# Altium project Car_Follower_Controller.PrjPcb
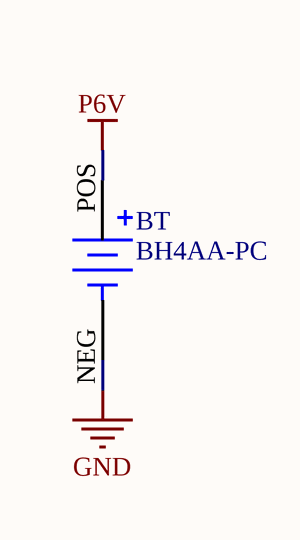
[diagram p0: Connectors.SchDoc]
5 sheets, 25 parts. Net scope: flat (ports and power ports of the same name join across sheets).
Board file: Auto_Follower_Controller.PcbDoc
Sheets:
  Connectors.SchDoc
  Main.SchDoc
  Power_Tree.SchDoc
  STM32.SchDoc
  STM32_Interfaces.SchDoc

## Sheet Connectors.SchDoc
size A; SheetNumber: 1; SheetTotal: 5

### Parts
BT  BH4AA-PC  [BAT_BH4AA-PC]

### Nets
GND: BT.NEG
P6V: BT.POS

### Library data of the parts
BT = BH4AA-PC: Battery Holder _Open_ AA 4 Cell PC Pin; MP: BH4AAPC; MF: MPD; Availability: Unavailable; SnapEDA_Link: https://www.snapeda.com/parts/BH4AAPC/MPD/view-part/112528/?ref=snap; Price: None; Package: None; Value: *

## Sheet Main.SchDoc
size A; SheetNumber: 1; SheetTotal: 3

## Sheet Power_Tree.SchDoc
size A; SheetNumber: 3; SheetTotal: 5
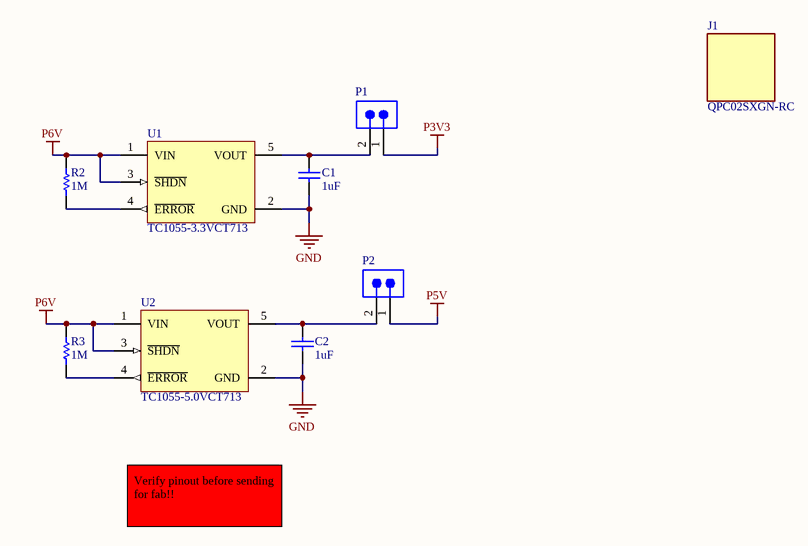
[diagram p1: Power_Tree.SchDoc]

### Parts
C1  value 1uF  [FOOTPRINT-1206-GEN]  (hidden comment: 1206 1uF)
C2  value 1uF  [FOOTPRINT-1206-GEN]  (hidden comment: 1206 1uF)
J1  QPC02SXGN-RC  [FP-QPC02SXGN-RC-MFG]
P1  TSW-102-26-F-S  [SMTC-TSW-102-26-XX-S]  (value not drawn)
P2  TSW-102-26-F-S  [SMTC-TSW-102-26-XX-S]  (value not drawn)
R2  1M  [RESC3116X65X50NL20T20]
R3  1M  [RESC3116X65X50NL20T20]
U1  TC1055-3.3VCT713  [SOT-23-CT5_L]
U2  TC1055-5.0VCT713  [SOT-23-CT5_N]

### Nets
GND: C1.1 C2.1 U1.2(GND) U2.2(GND)
P3V3: P1.1
P5V: P2.1
P6V: R2.2 R3.2 U1.1(VIN) U1.3(~{SHDN}) U2.1(VIN) U2.3(~{SHDN})
NetC1_2: C1.2 P1.2 U1.5(VOUT)
NetC2_2: C2.2 P2.2 U2.5(VOUT)
NetR2_1: R2.1 U1.4(~{ERROR})
NetR3_1: R3.1 U2.4(~{ERROR})

### Notes on the sheet
- Verify pinout before sending for fab!!

### Library data of the parts
C1 C2 = CMP-001-00085-2: CAP CER 1UF 50V X7R 1206 ±10% 50V Ceramic Capacitor X7R 1206 (3216 Metric); Part Number: 1276-6781-1-ND; Published: 8-Jun-2000; LatestRevisionNote: Re-released for DXP Platform.; PackageReference: RAD-0.3; Publisher: Altium Limited; PackageDescription: Radial Cap, Thru-Hole; 2 Leads; 0.3 in Pin Spacing; Design Item ID: Capacitor-Generic-1206; Source: Generic.SchLib; Type: Capacitor
J1 = CMP-25666-000001-1: CONN JUMPER SHORTING .100" GOLD; Manufacturer: Sullins; Conn Orientation: Straight; Pitch: 2.54mm; Current Rating: 3A; Number Of Contacts: 2; Category: Conn; Temperature Range Low: -40°C; Temperature Range High: +85°C; Device Class L1: Connectors; Lead Free: Yes; Manufacturer Part Number: QPC02SXGN-RC; Automotive: No; Height: 6.17mm; ComponentLink2URL: https://s3.amazonaws.com/catalogspreads-pdf/PAGE128-129%20.100%20JUMPER.pdf; Device Class L2: unset; Footprint Url: https://drawings-pdf.s3.amazonaws.com/11510.pdf; Device Class L3: unset; Temperature: -40°C to +85°C; RoHS: TRUE; Digikey Description: CONN JUMPER SHORTING .100" GOLD; Octopart: https://octopart.com/qpc02sxgn-rc-sullins-19878795; Package: 0; ComponentLink2Description: Datasheet; Contact Material: Gold
P1 P2 = CMP-002-00072-1: Headers & Wire Housings Classic PCB Header Strips, 0.100 pitch; Number of Positions: 2; Max Voltage Rating (AC): 550V; Gender: Male; Pitch: 2.54mm; Contact Post Length: 3.2mm; Voltage Rating: 500V; Max Current Rating: 7.6A; Contact Material: Bronze; Contact Gender: Male; Contact Type: -; REACH SVHC: No SVHC; Min Operating Temperature: -55°C; Housing Material: Polyester; Packaging: Bulk; Termination: Through Hole; Max Operating Temperature: 125°C; Orientation: Vertical; Flammability Rating: UL94 V-0; Package Quantity: 1; Depth: 2.54mm; Contact Plating: Gold; Number of Rows: 1; Radiation Hardening: No; Number of Contacts: 2; Length: 5.08mm; RoHS Compliant: Yes; Housing Color: Black; Weight: 0.001257oz; Contact Mating Length: 5.84mm; Series: TSW
R2 R3 = CMP-2003-04887-1: CRCW12061M00FKEAHP / 1M 1206; Manufacturer: Vishay Dale; Part Number: CRCW12061M00FKEAHP
U1 = CMP-0136-00572-1: 50 mA, 100 mA and 150 mA CMOS LDOs with Shutdown and Active-Low Error Output, 5-Pin SOT-23, Extended Temperature, Tape and Reel; PackageVersion: revBB, Aug-2009; PackageDescription: 5-Lead Plastic Small Outline Transistor (CT) [SOT-23]; PackageReference: SOT-23-CT5; Code_IPC: SOT23-5; DatasheetVersion: revD, Feb-2007
U2 = CMP-0136-00550-1: 50 mA, 100 mA and 150 mA CMOS LDOs with Shutdown and Active-Low Error Output, 5-Pin SOT-23, Extended Temperature, Tape and Reel; PackageReference: SOT-23-CT5; PackageDescription: 5-Lead Plastic Small Outline Transistor (CT) [SOT-23]; Code_IPC: SOT23-5; DatasheetVersion: revD, Feb-2007; PackageVersion: revBB, Aug-2009

## Sheet STM32.SchDoc
size A; SheetNumber: 4; SheetTotal: 5
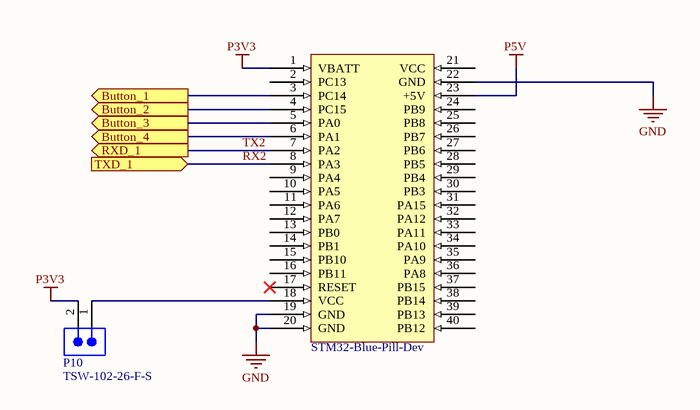
[diagram p2: STM32.SchDoc]

### Parts
(Parts that share a designator on the sheet are numbered #1, #2 ... from top to bottom, then left to right.)
*#1  STM32-Blue-Pill-Dev  [STM32-Blue-Pill-Dev-Headers]
P10  TSW-102-26-F-S  [SMTC-TSW-102-26-XX-S]

### Ports
Button_1 (out), Button_2 (out), Button_3 (out), Button_4 (out), RXD_1 (out), TXD_1 (in)

### Nets
GND: *#1.19(GND) *#1.20(GND) *#1.22(GND)
P3V3: *#1.1(VBATT) P10.2
P5V: *#1.23(+5V)
RX2: *#1.8(PA3) ; port TXD_1
TX2: *#1.7(PA2) ; port RXD_1
Net*#1_3: *#1.3(PC14) ; port Button_1
Net*#1_4: *#1.4(PC15) ; port Button_2
Net*#1_5: *#1.5(PA0) ; port Button_3
Net*#1_6: *#1.6(PA1) ; port Button_4
Net*#1_18: *#1.18(VCC) P10.1

Not connected (* = marked no-connect by the designer): *#1 2(PC13) 9(PA4) 10(PA5) 11(PA6) 12(PA7) 13(PB0) 14(PB1) 15(PB10) 16(PB11) 17(RESET)* 21(VCC) 24(PB9) 25(PB8) 26(PB7) 27(PB6) 28(PB5) 29(PB4) 30(PB3) 31(PA15) 32(PA12) 33(PA11) 34(PA10) 35(PA9) 36(PA8) 37(PB15) 38(PB14) 39(PB13) 40(PB12)

### Library data of the parts
P10 = CMP-002-00072-1: as P1 on sheet Power_Tree; Contact Material: Bronze; Contact Gender: Male; Contact Type: -; REACH SVHC: No SVHC; Min Operating Temperature: -55°C; Housing Material: Polyester; Packaging: Bulk; Termination: Through Hole; Max Operating Temperature: 125°C; Orientation: Vertical; Flammability Rating: UL94 V-0; Package Quantity: 1; Depth: 2.54mm; Contact Plating: Gold; Number of Rows: 1; Radiation Hardening: No; Number of Contacts: 2; Length: 5.08mm; RoHS Compliant: Yes; Housing Color: Black; Weight: 0.001257oz; Contact Mating Length: 5.84mm; Series: TSW

## Sheet STM32_Interfaces.SchDoc
size A; SheetNumber: 5; SheetTotal: 5
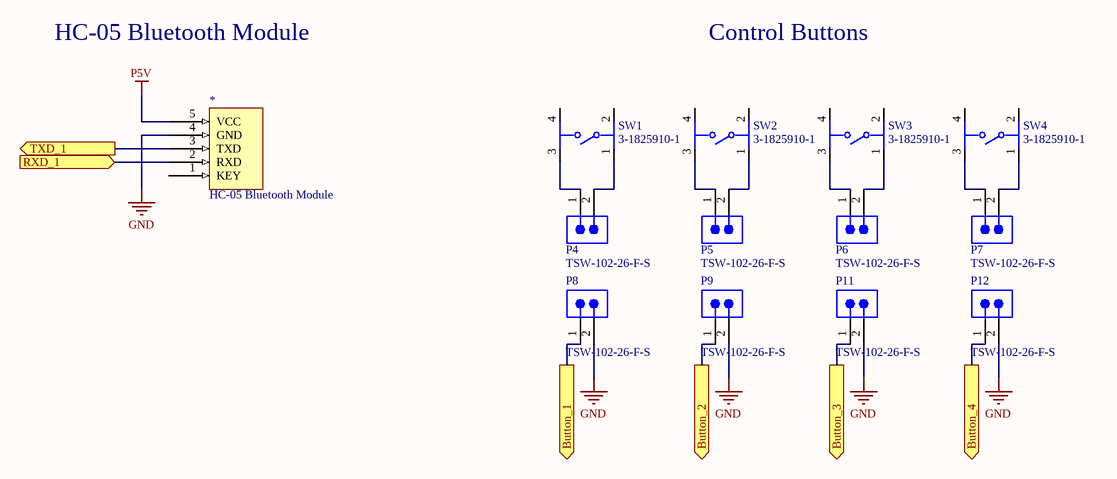
[diagram p3: STM32_Interfaces.SchDoc]

### Parts
(Parts that share a designator on the sheet are numbered #1, #2 ... from top to bottom, then left to right.)
*#2  HC-05 Bluetooth Module  [HC-05 Bluetooth Module]
P4  TSW-102-26-F-S  [SMTC-TSW-102-26-XX-S]
P5  TSW-102-26-F-S  [SMTC-TSW-102-26-XX-S]
P6  TSW-102-26-F-S  [SMTC-TSW-102-26-XX-S]
P7  TSW-102-26-F-S  [SMTC-TSW-102-26-XX-S]
P8  TSW-102-26-F-S  [SMTC-TSW-102-26-XX-S]
P9  TSW-102-26-F-S  [SMTC-TSW-102-26-XX-S]
P11  TSW-102-26-F-S  [SMTC-TSW-102-26-XX-S]
P12  TSW-102-26-F-S  [SMTC-TSW-102-26-XX-S]
SW1  3-1825910-1  [FP-3-1825910-1-MFG]
SW2  3-1825910-1  [FP-3-1825910-1-MFG]
SW3  3-1825910-1  [FP-3-1825910-1-MFG]
SW4  3-1825910-1  [FP-3-1825910-1-MFG]

### Ports
Button_1 (out), Button_2 (out), Button_3 (out), Button_4 (out), RXD_1 (in), TXD_1 (out)

### Nets
GND: *#2.4(GND) P8.2 P9.2 P11.2 P12.2
P5V: *#2.5(VCC)
RX2: *#2.3(TXD) ; port TXD_1
TX2: *#2.2(RXD) ; port RXD_1
Net*#1_3: P8.1 ; port Button_1
Net*#1_4: P9.1 ; port Button_2
Net*#1_5: P11.1 ; port Button_3
Net*#1_6: P12.1 ; port Button_4
NetP4_1: P4.1 SW1.3
NetP4_2: P4.2 SW1.1
NetP5_1: P5.1 SW2.3
NetP5_2: P5.2 SW2.1
NetP6_1: P6.1 SW3.3
NetP6_2: P6.2 SW3.1
NetP7_1: P7.1 SW4.3
NetP7_2: P7.2 SW4.1

Not connected (* = marked no-connect by the designer): *#2 1(KEY); SW1 2 4; SW2 2 4; SW3 2 4; SW4 2 4

### Notes on the sheet
- HC-05 Bluetooth Module
- Control Buttons

### Library data of the parts
P4-P9 P11 P12 = CMP-002-00072-1: as P1 on sheet Power_Tree; Contact Material: Bronze; Contact Gender: Male; Contact Type: -; REACH SVHC: No SVHC; Min Operating Temperature: -55°C; Housing Material: Polyester; Packaging: Bulk; Termination: Through Hole; Max Operating Temperature: 125°C; Orientation: Vertical; Flammability Rating: UL94 V-0; Package Quantity: 1; Depth: 2.54mm; Contact Plating: Gold; Number of Rows: 1; Radiation Hardening: No; Number of Contacts: 2; Length: 5.08mm; RoHS Compliant: Yes; Housing Color: Black; Weight: 0.001257oz; Contact Mating Length: 5.84mm; Series: TSW
SW1-SW4 = CMP-03407-000001-1: SWITCH TACTILE SPST-NO 0.05A 24V; Manufacturer: TE Connectivity; Operating Force: 160gf; Contact Current Rating: 50mA; Contact Resistance: 100mΩ; Electromechanical Life: 100000Cycles; Device Class L1: Electromechanical; ComponentLink2URL: https://www.te.com/commerce/DocumentDelivery/DDEController?Action=srchrtrv&DocNm=1825910&DocType=Customer+Drawing&DocLang=English; Category: Switch; Device Class L2: Switches; Temperature: -35°C to +85°C; RoHS: TRUE; Mount: Through Hole; Manufacturer Part Number: 3-1825910-1; Automotive: No; Lead Free: Yes; Device Class L3: Tactile Switches; ComponentLink2Description: Datasheet; Temperature Range High: +85°C; Height: 17.3mm; Package: 0; Temperature Range Low: -35°C; Throw Configuration: SPST-NO; Digikey Description: SWITCH TACTILE SPST-NO 0.05A 24V; Octopart: https://octopart.com/3-1825910-1-te+connectivity-46506874

## Nets that join several sheets
GND: Connectors (BT.NEG), Power_Tree (C1.1 C2.1 U1.2 U2.2), STM32 (*#1.19 *#1.20 *#1.22), STM32_Interfaces (5 pins)
P3V3: Power_Tree (P1.1), STM32 (*#1.1 P10.2)
P5V: Power_Tree (P2.1), STM32 (*#1.23), STM32_Interfaces (*#2.5)
P6V: Connectors (BT.POS), Power_Tree (6 pins)
Net*#1_3: STM32 (*#1.3), STM32_Interfaces (P8.1)
Net*#1_4: STM32 (*#1.4), STM32_Interfaces (P9.1)
Net*#1_5: STM32 (*#1.5), STM32_Interfaces (P11.1)
Net*#1_6: STM32 (*#1.6), STM32_Interfaces (P12.1)
RX2: STM32 (*#1.8), STM32_Interfaces (*#2.3)
TX2: STM32 (*#1.7), STM32_Interfaces (*#2.2)